# Altium schematic sheet ESP8266.SchDoc
size A4; SheetNumber: 6; SheetTotal: 6
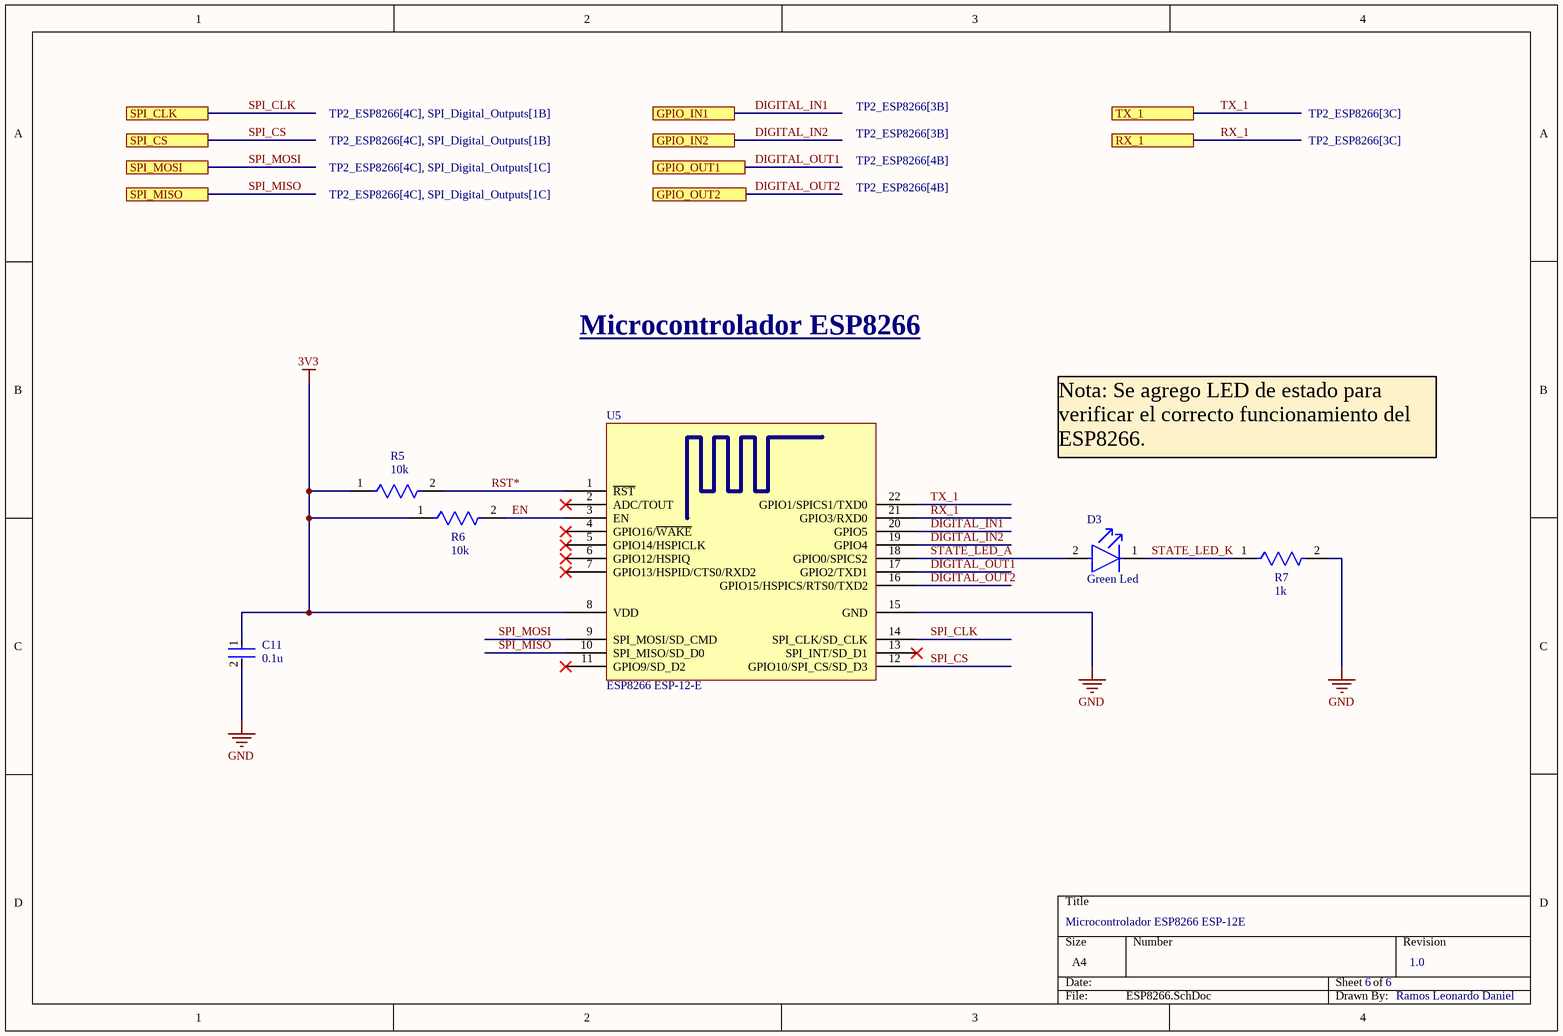
[diagram p0: ESP8266.SchDoc]

## Parts
C11  value 0.1u  [FP-CC0805-0_85-MFG]  (hidden comment: CC0805KRX7R8BB104)
D3  Green Led  [FP-LTST-C190GKT-MFG]
R5  Resistance: 10k  [FP-CRCW0805-e3-IPC_B]  (hidden comment: CRCW08054K70JNEA)
R6  Resistance: 10k  [FP-CRCW0805-e3-IPC_B]  (hidden comment: CRCW08054K70JNEA)
R7  Resistance: 1k  [FP-CRCW0805-e3-IPC_B]  (hidden comment: CRCW08054K70JNEA)
U5  ESP8266 ESP-12-E  [ESP8266 ESP-12-E]

## Ports
GPIO_IN1 (see TP2_ESP8266[3B]), GPIO_IN2 (see TP2_ESP8266[3B]), GPIO_OUT1 (see TP2_ESP8266[4B]), GPIO_OUT2 (see TP2_ESP8266[4B]), RX_1 (see TP2_ESP8266[3C]), SPI_CLK (see TP2_ESP8266[4C], SPI_Digital_Outputs[1B]), SPI_CS (see TP2_ESP8266[4C], SPI_Digital_Outputs[1B]), SPI_MISO (see TP2_ESP8266[4C], SPI_Digital_Outputs[1C]), SPI_MOSI (see TP2_ESP8266[4C], SPI_Digital_Outputs[1C]), TX_1 (see TP2_ESP8266[3C])

## Nets
3V3: C11.1 R5.1 R6.1 U5.8(VDD)
GND: C11.2 R7.2 U5.15(GND)
DIGITAL_IN1: U5.20(GPIO5) ; port GPIO_IN1
DIGITAL_IN2: U5.19(GPIO4) ; port GPIO_IN2
DIGITAL_OUT1: U5.17(GPIO2/TXD1) ; port GPIO_OUT1
DIGITAL_OUT2: U5.16(GPIO15/HSPICS/RTS0/TXD2) ; port GPIO_OUT2
EN: R6.2 U5.3(EN)
RST*: R5.2 U5.1(~{RST})
RX_1: U5.21(GPIO3/RXD0) ; port RX_1
SPI_CLK: U5.14(SPI_CLK/SD_CLK) ; port SPI_CLK
SPI_CS: U5.12(GPIO10/SPI_CS/SD_D3) ; port SPI_CS
SPI_MISO: U5.10(SPI_MISO/SD_D0) ; port SPI_MISO
SPI_MOSI: U5.9(SPI_MOSI/SD_CMD) ; port SPI_MOSI
STATE_LED_A: D3.2(A) U5.18(GPIO0/SPICS2)
STATE_LED_K: D3.1(C) R7.1
TX_1: U5.22(GPIO1/SPICS1/TXD0) ; port TX_1

Not connected (* = marked no-connect by the designer): U5 2(ADC/TOUT)* 4(GPIO16/~{WAKE})* 5(GPIO14/HSPICLK)* 6(GPIO12/HSPIQ)* 7(GPIO13/HSPID/CTS0/RXD2)* 11(GPIO9/SD_D2)* 13(SPI_INT/SD_D1)*

## Notes on the sheet
- Microcontrolador ESP8266
- Nota: Se agrego LED de estado para verificar el correcto funcionamiento del ESP8266.
- Microcontrolador ESP8266 ESP-12E
- 6
- 1.0
- Ramos Leonardo Daniel

## Library data of the parts
C11 = CMP-1036-04410-2: CAP CER 0.1UF 25V X7R 0805; Manufacturer: Yageo; Tolerance: 0.1; Material: Ceramic; Capacitance: 100 nF; ComponentLink2URL: http://www.yageo.com/documents/recent/UPY-GPHC_Y5V_6.3V-to-50V_8.pdf; Category: Cap; Mouser Description: Multilayer Ceramic Capacitors MLCC - SMD/SMT 100nF 25V X7R 10%; Manufacturer Part Number: CC0805KRX7R8BB104; Device Class L1: Passive Components; Footprint Url: http://www.yageo.com/exep/pages/download/literatures/UPY-C_GEN_24.pdf; Height: 0.95mm; Digikey Description: CAP CER 0.1UF 25V X7R 0805; Lead Free: Yes; Temperature Range High: +85°C; Temperature: -30°C to +85°C; Ipc Land Pattern Name: CAPC200125X85; Automotive: No; Octopart: https://octopart.com/cc0805krx7r8bb104-yageo-39467766; Device Class L2: Capacitors; Temperature Characteristic: X7R; Voltage Rating: 25 V; ComponentLink2Description: Datasheet; Temperature Range Low: -30°C; Device Class L3: Ceramic Capacitors; RoHS: TRUE; Package: CC0805-0.85
D3 = CMP-22017-000005-2: LED GREEN CLEAR CHIP SMD LTST-C190GKT; Dominant Wavelength: 569nm; Reverse Voltage: 5V; Lens Color: Colorless; Viewing Angle: 130°; Voltage: 2V; Forward Current: 30mA; Power Dissipation: 100mW; Luminous Intensity: 6mcd; Number of LEDs: 1; Forward Voltage: 2.1V; Wavelength: 565nm; Test Current: 10mA; Min Operating Temperature: -55°C; Lens Style: Clear; Mount: Surface Mount; Width: 0.8mm; Packaging: Tape and Reel; Lens Transparency: Clear; Case Code (Metric): 1608; Depth: 0.8mm; Case Code (Imperial): 0603; Case/Package: 0603; Number of Pins: 2; Max Operating Temperature: 85°C; Lead Free: Lead Free; Number of Elements: 1; Length: 1.6mm; Height: 0.8mm; Package Quantity: 1; Power Rating: 100mW; Radiation Hardening: No; Illumination Color: Green; Color: Green
R5-R7 = CMP-2001-03967-2: RES Thick Film, 4.7kΩ, 5%, 0.125W, 200ppm/°C, 0805; Power Rating: 125mW; Voltage Rating: 150V; Radiation Hardening: No; Case Code (Imperial): 0805; Military Standard: Not; Contact Plating: Tin; Weight: 0.000194oz; Mount: Surface Mount; Termination: SMD/SMT; Packaging: Tape and Reel; Min Operating Temperature: -55°C; Width: 1.25mm; Tolerance: 5%; Height: 0.45mm; Depth: 1.25mm; Length: 2mm; Temperature Coefficient: 200ppm/°C; Case Code (Metric): 2012; Package Quantity: 5000; Max Operating Temperature: 155°C; Case/Package: 0805; Composition: Thick Film